# Altium schematic sheet Tesis_Driver_TMC2209.SchDoc
size A4; SheetNumber: 1; SheetTotal: 1
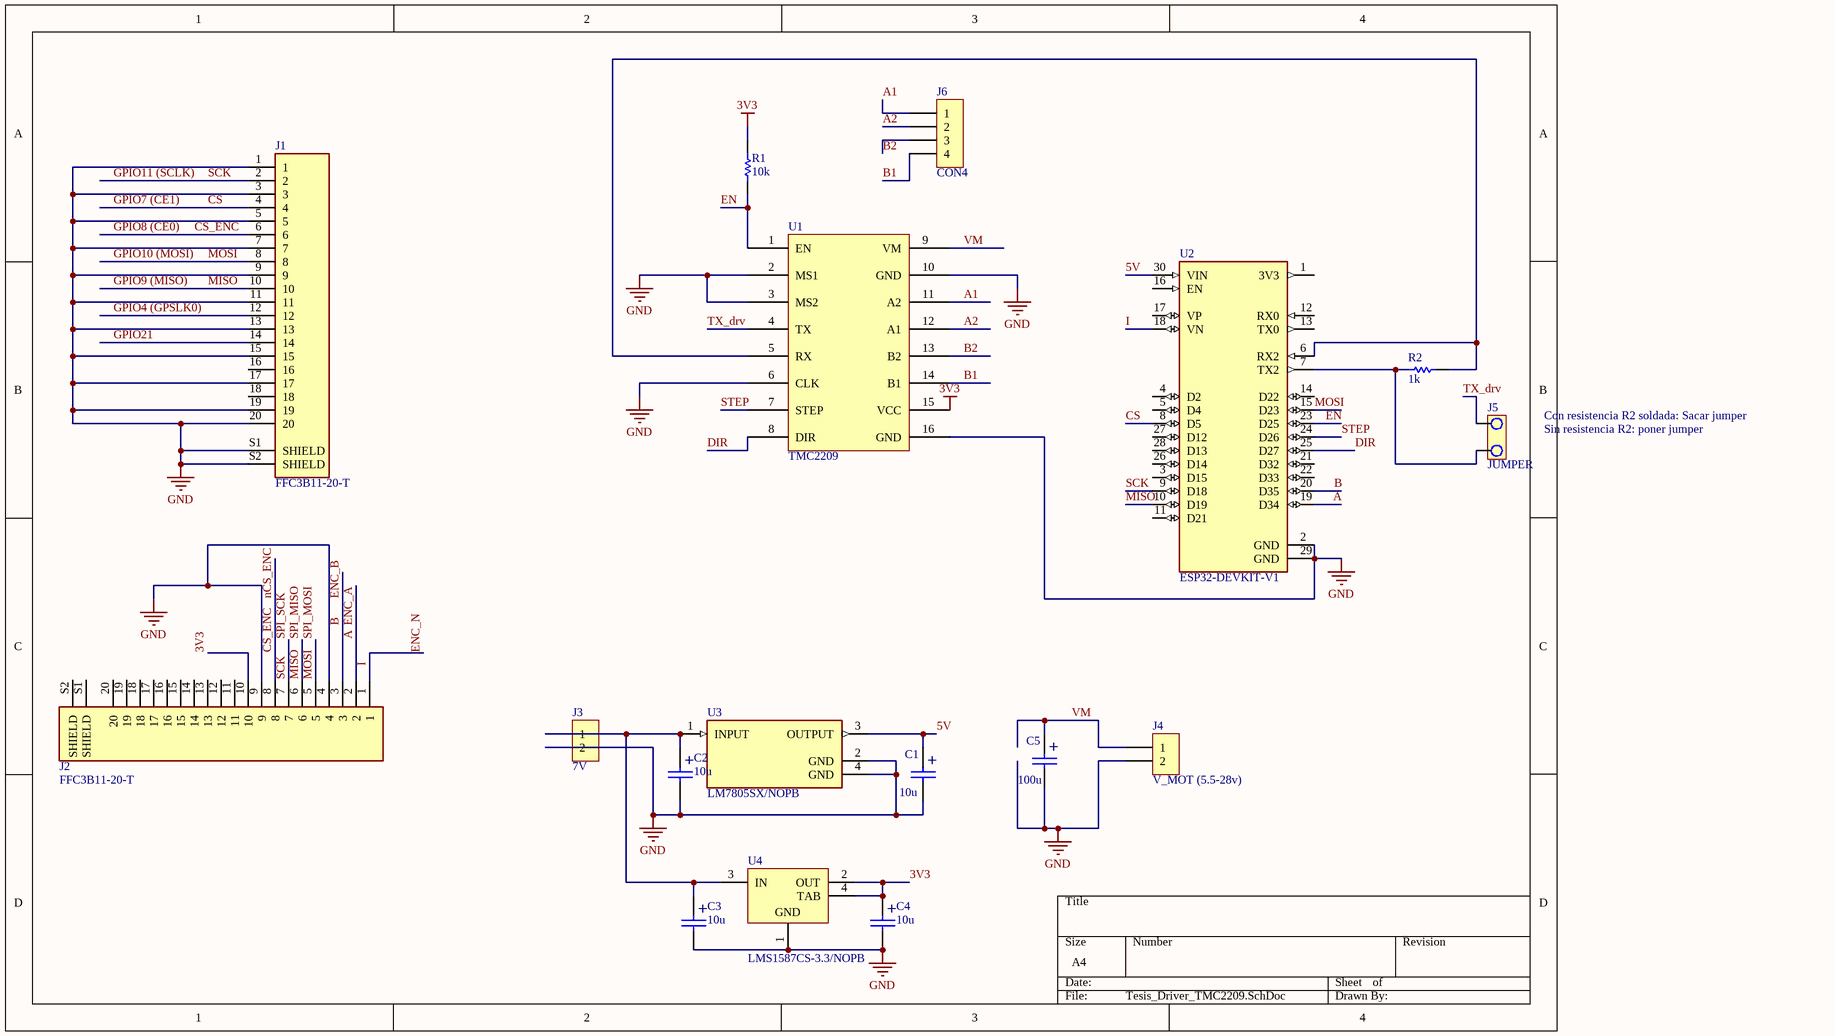
[diagram p0: Tesis_Driver_TMC2209.SchDoc]

## Parts
C1  10u  [CAP100RP]
C2  10u  [CAP100RP]
C3  10u  [CAP100RP]
C4  10u  [CAP100RP]
C5  100u  [CAP100RP]
J1  FFC3B11-20-T  [GCT_FFC3B11-20-T]
J2  FFC3B11-20-T  [GCT_FFC3B11-20-T]
J3  7V  [BORNERA2]
J4  V_MOT (5.5-28v)  [BORNERA2]
J5  JUMPER  [JUMPER2]
J6  CON4  [SIP4]
R1  10k  [RES400]
R2  1k  [RES400]
U1  TMC2209  [TMC2209]
U2  ESP32-DEVKIT-V1  [MODULE_ESP32_DEVKIT_V1]
U3  LM7805SX/NOPB  [FP-KTT0003B-MFG]
U4  LMS1587CS-3.3/NOPB  [KTT0003B_N]

## Nets
3V3: C4.1 J2.10 R1.2 U1.15(VCC) U4.2(OUT) U4.4(TAB)
GND: C1.2 C2.2 C3.2 C4.2 C5.2 J1.1 J1.3 J1.5 J1.7 J1.9 J1.11 J1.13 J1.15 J1.17 J1.19 J1.20 J1.S1(SHIELD) J1.S2(SHIELD) J2.4 J2.9 J3.2 J4.2 U1.2(MS1) U1.3(MS2) U1.6(CLK) U1.10(GND) U1.16(GND) U2.2(GND) U2.29(GND) U3.2(GND) U3.4(GND) U4.1(GND)
5V: C1.1 U2.30(VIN) U3.3(OUTPUT)
A: J2.2 U2.19(D34)  [also labelled ENC_A]
A1: J6.1 U1.11(A2)
A2: J6.2 U1.12(A1)
B: J2.3 U2.20(D35)  [also labelled ENC_B]
B1: J6.4 U1.14(B1)
B2: J6.3 U1.13(B2)
CS: J1.4 U2.8(D5)  [also labelled GPIO7 (CE1)]
CS_ENC: J1.6 J2.8  [also labelled GPIO8 (CE0), nCS_ENC]
DIR: U1.8(DIR) U2.25(D27)
EN: R1.1 U1.1(EN) U2.23(D25)
ENC_N: J2.1 U2.18(VN)  [also labelled I]
GPIO4 (GPSLK0): J1.12
GPIO9 (MISO): J1.10 J2.6 U2.10(D19)  [also labelled MISO, SPI_MISO]
GPIO10 (MOSI): J1.8 J2.5 U2.15(D23)  [also labelled MOSI, SPI_MOSI]
GPIO11 (SCLK): J1.2 J2.7 U2.9(D18)  [also labelled SCK, SPI_SCK]
GPIO21: J1.14
STEP: U1.7(STEP) U2.24(D26)
TX_drv: J5.2 U1.4(TX)
VM: C5.1 J4.1 U1.9(VM)
NetC2_1: C2.1 C3.1 J3.1 U3.1(INPUT) U4.3(IN)
NetJ5_1: J5.1 R2.2 U2.7(TX2)
NetR2_1: R2.1 U1.5(RX) U2.6(RX2)

Not connected (* = marked no-connect by the designer): J1 16 18; J2 11 12 13 14 15 16 17 18 19 20 S1(SHIELD) S2(SHIELD); U2 1(3V3) 3(D15) 4(D2) 5(D4) 11(D21) 12(RX0) 13(TX0) 14(D22) 16(EN) 17(VP) 21(D32) 22(D33) 26(D14) 27(D12) 28(D13)

## Notes on the sheet
- (near J5) Con resistencia R2 soldada: Sacar jumper
- (near J5) Sin resistencia R2: poner jumper
- (in symbol CAPPOL) +

## Library data of the parts
C1-C5 = CAPPOL
J1 J2 = FFC3B11-20-T: 20 Position FFC, FPC Connector Contacts, Top 0.039 (1.00mm) Surface Mount, Right Angle; MF: Global Connector Technology; SnapEDA_Link: https://www.snapeda.com/parts/FFC3B11-20-T/Global+Connector+Technology/view-part/?ref=snap; Package: None; Value: *; MP: FFC3B11-20-T; Check_prices: https://www.snapeda.com/parts/FFC3B11-20-T/Global+Connector+Technology/view-part/?ref=eda
J3 J4 = BORNERA 2
R1 R2 = RES
U2 = ESP32-DEVKIT-V1: Dual core, Wi-Fi: 2.4 GHz up to 150 Mbits/s,BLE (Bluetooth Low Energy) and legacy Bluetooth, 32 bits, Up to 240 MHz; MF: Do it; SnapEDA_Link: https://www.snapeda.com/parts/ESP32-DEVKIT-V1/Do+it/view-part/?ref=snap; Package: None; Value: *; MP: ESP32-DEVKIT-V1; Check_prices: https://www.snapeda.com/parts/ESP32-DEVKIT-V1/Do+it/view-part/?ref=eda
U3 = CMP-2000-07590-2: IC REG LIN 5V 1.5A DDPAK/TO263-3; Manufacturer: Texas Instruments; Standoff Height: 0mm; Number Of Outputs: 1; Nominal Supply Current: 8mA; Output Type: Fixed; Accuracy Percentage: 3%; Dropout Voltage: 2V; Min Supply Voltage: 7.5V; Max Junction Temp: +150°C; Max Supply Voltage: 30V; Device Class L1: Integrated Circuits (ICs); Mouser Description: 1.5-A, Wide VIN Fixed Voltage Regulators 3-DDPAK/TO-263 0 to 0; Device Class L3: Voltage Regulators - Linear; Height: 4.79mm; Temperature Range High: +125°C; Manufacturer Part Number: LM7805SX/NOPB; Octopart: https://octopart.com/lm7805sx%2Fnopb-texas+instruments-74629994; Automotive: No; Output Voltage: 5V; Lead Free: Yes; Digikey Description: IC REG LIN 5V 1.5A DDPAK/TO263-3; Package: KTT0003B; Device Class L2: Power Management ICs; ComponentLink2URL: http://www.ti.com/lit/ds/symlink/lm7800.pdf; Category: IC; Temperature Range Low: 0°C; Ambient Temperature Range High: +125°C; Output Current: 1.5A; Ambient Temperature Range Low: 0°C; RoHS: TRUE; Temperature: 0°C to +125°C; ComponentLink2Description: Datasheet
U4 = CMP-0062-00169-5: 3A Low Dropout Fast Response Regulators, 3-pin TO-263, Pb-Free; Manufacturer: Texas Instruments; High-Reliability: Y; PowerWise: N; PackageTopMarking: NSUZXYTTE#*LMS1587*CS-3.3; CompType: LDO IC; PackageDescription: TO-263, Molded, .400 x .390 x .180in, 3 Lead, .1in Pitch, Surface Mount; PackageReference: KTT0003B; RoHS: Y; PinCount: 3; ComponentLink1Description: Datasheet URL; ComponentLink1URL: http://www.ti.com/general/docs/lit/getliterature.tsp?genericPartNumber=LMS1587&fileType=pdf; Code_JEDEC: MO-169-AA; PartNumber: LMS1587CS-3.3/NOPB